# EasyEDA schematic Flipper.json
TITLE: Sheet_1; REV: 1.0; Date: 2022-10-20; Sheet: 1/1; Company: Your Company
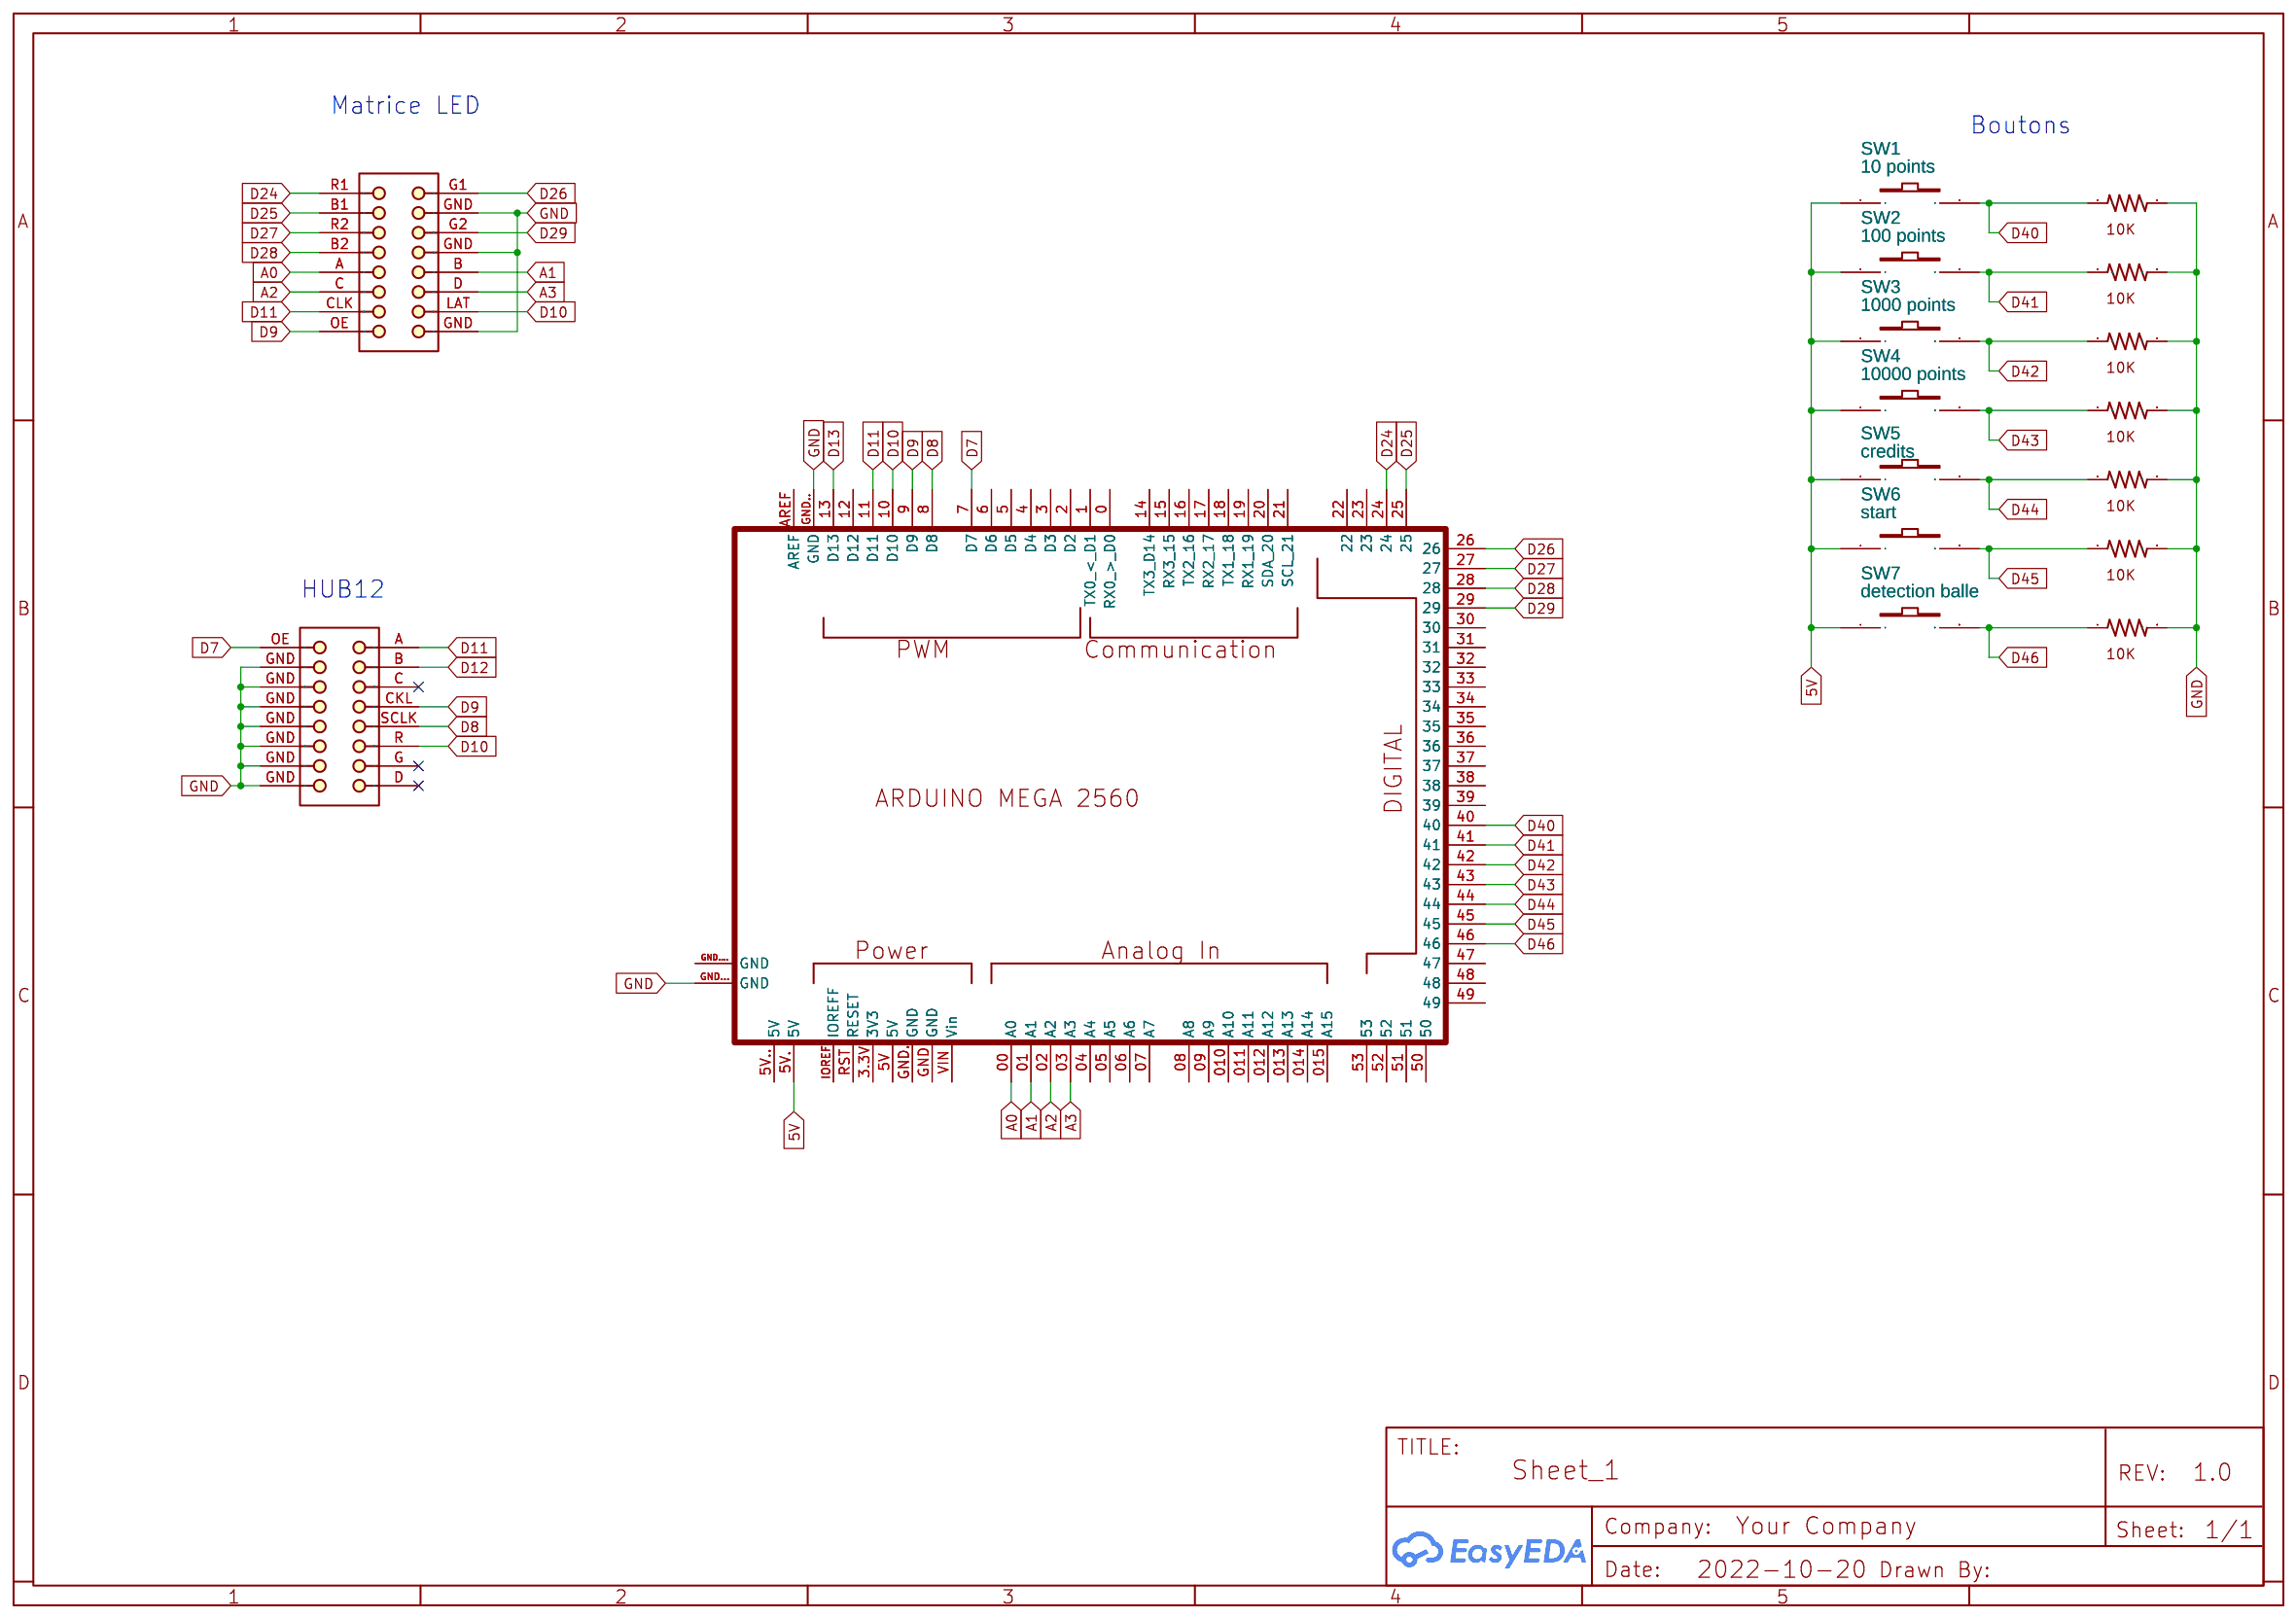
[diagram p0: schematic sheet]

## Parts
R1  10K-OHM-RESISTOR  [10K-OHM-RESISTOR]
R2  10K-OHM-RESISTOR  [10K-OHM-RESISTOR]
R3  10K-OHM-RESISTOR  [10K-OHM-RESISTOR]
R4  10K-OHM-RESISTOR  [10K-OHM-RESISTOR]
R5  10K-OHM-RESISTOR  [10K-OHM-RESISTOR]
R6  10K-OHM-RESISTOR  [10K-OHM-RESISTOR]
R7  10K-OHM-RESISTOR  [10K-OHM-RESISTOR]
SMD1  Matrice LED  [918516X329]
SMD2  Matrice LED  [918516X329]
SW1  10 points  [SPST-PUSHBUTTON-02]
SW2  100 points  [SPST-PUSHBUTTON-02]
SW3  1000 points  [SPST-PUSHBUTTON-02]
SW4  10000 points  [SPST-PUSHBUTTON-02]
SW5  credits  [SPST-PUSHBUTTON-02]
SW6  start  [SPST-PUSHBUTTON-02]
SW7  detection balle  [SPST-PUSHBUTTON-02]
U1  ARDUINO MEGA 2560 R3 V1.0  [TWIX_MEGA_PCB____ARDUINO-MEGA2560-FOOTPRINT_]

## Library data of the parts
R1-R7 = 10K-OHM-RESISTOR: Contributor: wozlaser
SMD1 SMD2 = 09_18_516_6329: Flat Cable Connector (IDC), Standard Male Header, Straight Press-in Pin, 16 Contacts, Performance Level 2; Contributor: Spartaco_Landi
SW1-SW7 = Pushbutton-02: Contributor: cpu76239
U1 = ARDUINO MEGA 2560 R3 V1.0: Contributor: pelz1234567890987654321

## Nets
5V: SW1.1 SW2.1 SW3.1 SW4.1 SW5.1 SW6.1 SW7.1 U1.5V.(5V)
GND: R1.2 R2.2 R3.2 R4.2 R5.2 R6.2 R7.2 SMD1.GND(16) SMD2.GND(15) U1.GND..(GND) U1.GND...(GND)
A0: SMD1.A(9) U1.00(A0)
A1: SMD1.B(10) U1.01(A1)
A2: SMD1.C(11) U1.02(A2)
A3: SMD1.D(12) U1.03(A3)
D7: SMD2.OE(1) U1.7(D7)
D8: SMD2.SCLK(10) U1.8(D8)
D9: SMD1.OE(15) SMD2.CKL(8) U1.9(D9)
D10: SMD1.LAT(14) SMD2.R(12) U1.10(D10)
D11: SMD1.CLK(13) SMD2.A(2) U1.11(D11)
D12: SMD2.B(4)
D13: U1.13(D13)
D24: SMD1.R1(1) U1.24
D25: SMD1.B1(3) U1.25
D26: SMD1.G1(2) U1.26
D27: SMD1.R2(5) U1.27
D28: SMD1.B2(7) U1.28
D29: SMD1.G2(6) U1.29
D40: R1.1 SW1.2 U1.40
D41: R2.1 SW2.2 U1.41
D42: R3.1 SW3.2 U1.42
D43: R4.1 SW4.2 U1.43
D44: R5.1 SW5.2 U1.44
D45: R6.1 SW6.2 U1.45
D46: R7.1 SW7.2 U1.46

Not connected (* = marked no-connect by the designer): SMD2 C(6)* D(16)* G(14)*; U1 0(RX0 > D0) 1(TX0 < D1) 2(D2) 3(D3) 3.3V(3V3) 04(A4) 4(D4) 05(A5) 5(D5) 5V 5V..(5V) 06(A6) 6(D6) 07(A7) 08(A8) 09(A9) 010(A10) 011(A11) 012(A12) 12(D12) 013(A13) 014(A14) 14(TX3 D14) 015(A15) 15(RX3 15) 16(TX2 16) 17(RX2 17) 18(TX1 18) 19(RX1 19) 20(SDA 20) 21(SCL 21) 22 23 30 31 32 33 34 35 36 37 38 39 47 48 49 50 51 52 53 AREF GND GND.(GND) GND....(GND) IOREF(IOREFF) RST(RESET) VIN(Vin)

## Notes on the sheet
- Matrice LED
- Boutons
- HUB12
